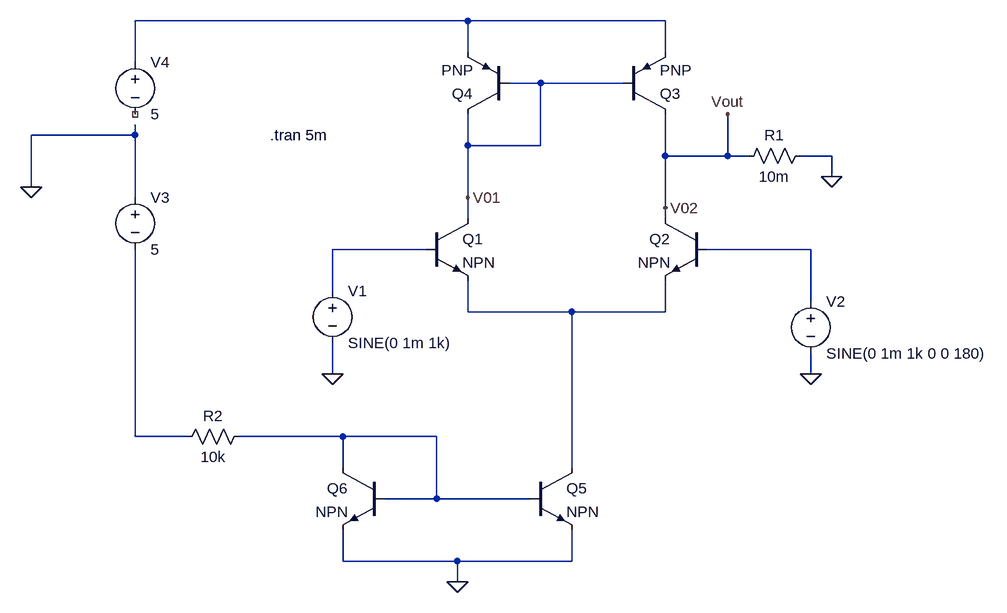
[diagram p0: schematic Draft7.asc]
Draft7.asc, the LTspice schematic file:
Version 4
SHEET 1 1160 836
WIRE 160 -48 -352 -48
WIRE 464 -48 160 -48
WIRE 160 0 160 -48
WIRE 464 0 464 -48
WIRE -352 16 -352 -48
WIRE 272 48 224 48
WIRE 400 48 272 48
WIRE -352 128 -352 112
WIRE -352 128 -512 128
WIRE 160 144 160 96
WIRE 272 144 272 48
WIRE 272 144 160 144
WIRE 464 160 464 96
WIRE 560 160 560 96
WIRE 560 160 464 160
WIRE 592 160 560 160
WIRE 720 160 672 160
WIRE 720 192 720 160
WIRE -512 208 -512 128
WIRE -352 224 -352 128
WIRE 160 224 160 144
WIRE 464 240 464 160
WIRE 160 256 160 224
WIRE 464 256 464 240
WIRE 96 304 -48 304
WIRE 688 304 528 304
WIRE -48 368 -48 304
WIRE 688 384 688 304
WIRE 160 400 160 352
WIRE 320 400 160 400
WIRE 464 400 464 352
WIRE 464 400 320 400
WIRE -48 496 -48 448
WIRE 688 496 688 464
WIRE -352 592 -352 304
WIRE -272 592 -352 592
WIRE -32 592 -192 592
WIRE 112 592 -32 592
WIRE -32 640 -32 592
WIRE 320 640 320 400
WIRE 112 688 112 592
WIRE 112 688 32 688
WIRE 256 688 112 688
WIRE -32 784 -32 736
WIRE 144 784 -32 784
WIRE 320 784 320 736
WIRE 320 784 144 784
WIRE 144 816 144 784
FLAG -48 496 0
FLAG -512 208 0
FLAG 688 496 0
FLAG 160 224 V01
FLAG 464 240 V02
FLAG 720 192 0
FLAG 560 96 Vout
FLAG 144 816 0
SYMBOL npn 96 256 R0
SYMATTR InstName Q1
SYMBOL npn 528 256 M0
SYMATTR InstName Q2
SYMBOL voltage -48 352 R0
WINDOW 123 0 0 Left 0
WINDOW 39 0 0 Left 0
SYMATTR InstName V1
SYMATTR Value SINE(0 1m 1k)
SYMBOL voltage 688 368 R0
WINDOW 123 0 0 Left 0
WINDOW 39 0 0 Left 0
SYMATTR InstName V2
SYMATTR Value SINE(0 1m 1k 0 0 180)
SYMBOL voltage -352 208 R0
SYMATTR InstName V3
SYMATTR Value 5
SYMBOL pnp 400 96 M180
SYMATTR InstName Q3
SYMBOL pnp 224 96 R180
SYMATTR InstName Q4
SYMBOL voltage -352 0 R0
SYMATTR InstName V4
SYMATTR Value 5
SYMBOL res 688 144 R90
WINDOW 0 0 56 VBottom 2
WINDOW 3 32 56 VTop 2
SYMATTR InstName R1
SYMATTR Value 10m
SYMBOL npn 256 640 R0
SYMATTR InstName Q5
SYMBOL npn 32 640 M0
SYMATTR InstName Q6
SYMBOL res -176 576 R90
WINDOW 0 0 56 VBottom 2
WINDOW 3 32 56 VTop 2
SYMATTR InstName R2
SYMATTR Value 10k
TEXT -144 128 Left 2 !.tran 5m

The netlist it stands for:
* Draft7.asc
Q1 V01 N002 N004 0 NPN
Q2 Vout N003 N004 0 NPN
V1 N002 0 SINE(0 1m 1k)
V2 N003 0 SINE(0 1m 1k 0 0 180)
V3 0 N005 5
Q3 Vout V01 N001 0 PNP
Q4 V01 V01 N001 0 PNP
V4 N001 NC_01 5
R1 0 Vout 10m
Q5 N004 N006 0 0 NPN
Q6 N006 N006 0 0 NPN
R2 N006 N005 10k
.model NPN NPN
.model PNP PNP
.lib standard.bjt
.tran 5m
.backanno
.end